# EAGLE schematic driver_1 (EAGLE 7.2.0)
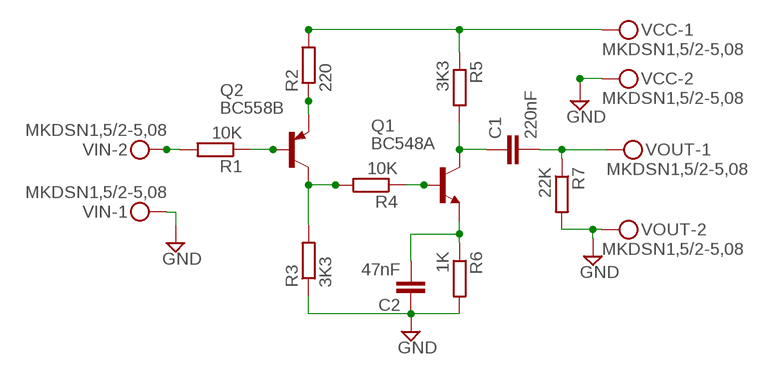
[diagram p0: schematic, sheet 1]

## Parts
C1  220nF  C-EU025-025X050  [C025-025X050]
C2  47nF  C-EU025-025X050  [C025-025X050]
Q1  BC548A  [TO92-EBC]
Q2  BC558B  [TO92-EBC]
R1  10K  R-EU_0207/7  [0207/7]
R2  220  R-EU_0207/7  [0207/7]
R3  3K3  R-EU_0207/7  [0207/7]
R4  10K  R-EU_0207/7  [0207/7]
R5  3K3  R-EU_0207/7  [0207/7]
R6  1K  R-EU_0207/7  [0207/7]
R7  22K  R-EU_0207/7  [0207/7]
VCC  MKDSN1,5/2-5,08  [MKDSN1,5/2-5,08]
VIN  MKDSN1,5/2-5,08  [MKDSN1,5/2-5,08]
VOUT  MKDSN1,5/2-5,08  [MKDSN1,5/2-5,08]

## Nets
GND: C2.1 R3.1 R6.2 R7.2 VCC.2 VIN.1 VOUT.2
N$1: Q2.B R1.1
N$2: Q2.E R2.1
N$3: Q2.C R3.2 R4.2
N$4: Q1.B R4.1
N$5: C1.1 Q1.C R5.2
N$6: C1.2 R7.1 VOUT.1
N$7: C2.2 Q1.E R6.1
N$8: R1.2 VIN.2
N$11: R2.2 R5.1 VCC.1

## Library data of the parts
C1 C2 = rcl:C-EU: CAPACITOR, European symbol
Q1 = transistor-npn:BC548*: NPN Transistor
Q2 = transistor-pnp:BC558*: PNP Transistror
R1-R7 = resistor:R-EU_: RESISTOR, European symbol
VCC VIN VOUT = con-phoenix-508:MKDSN1,5/2-5,08: MKDSN 1,5/ 2-5,08 Printklemme Nennstrom: 13,5 A Nennspannung: 250 V Rastermaß: 5,08 mm Polzahl: 2 Anschlussart: Schraubanschluss Montage: Löten Anschlussrichtung Leiter/Platine: 0 ° Artikelnummer: 1729128 Source: http://eshop.phoenixcontact.com .. 1729128.pdf